# Altium schematic sheet Encoders.SchDoc
size A4; SheetNumber: 5; SheetTotal: 5
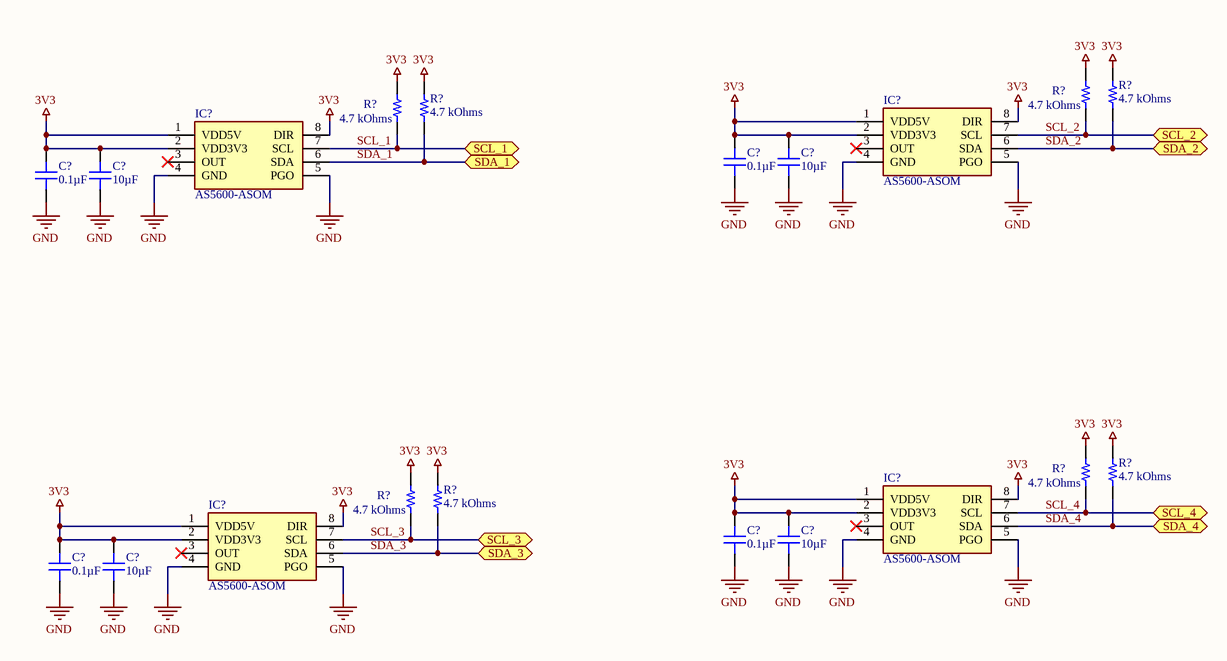
[diagram p0: Encoders.SchDoc]

## Parts
(Parts that share a designator on the sheet are numbered #1, #2 ... from top to bottom, then left to right.)
C?#1  0.1µF  [CAP 0603_1608]
C?#2  10µF  [CAP 0603_1608]
C?#3  0.1µF  [CAP 0603_1608]
C?#4  10µF  [CAP 0603_1608]
C?#5  0.1µF  [CAP 0603_1608]
C?#6  10µF  [CAP 0603_1608]
C?#7  0.1µF  [CAP 0603_1608]
C?#8  10µF  [CAP 0603_1608]
IC?#1  AS5600-ASOM  [SOIC127P600X175-8N]
IC?#2  AS5600-ASOM  [SOIC127P600X175-8N]
IC?#3  AS5600-ASOM  [SOIC127P600X175-8N]
IC?#4  AS5600-ASOM  [SOIC127P600X175-8N]
R?#1  4.7 kOhms  [FileName=C:\Users\Public\Documents\Altium\altium-library\footprints/Resistor - Chip/PCB - RESISTOR - CHIP - RES 0603_1608.PCBLIB|Footprint=RES 0603_1608]
R?#2  4.7 kOhms  [FileName=C:\Users\Public\Documents\Altium\altium-library\footprints/Resistor - Chip/PCB - RESISTOR - CHIP - RES 0603_1608.PCBLIB|Footprint=RES 0603_1608]
R?#3  4.7 kOhms  [FileName=C:\Users\Public\Documents\Altium\altium-library\footprints/Resistor - Chip/PCB - RESISTOR - CHIP - RES 0603_1608.PCBLIB|Footprint=RES 0603_1608]
R?#4  4.7 kOhms  [FileName=C:\Users\Public\Documents\Altium\altium-library\footprints/Resistor - Chip/PCB - RESISTOR - CHIP - RES 0603_1608.PCBLIB|Footprint=RES 0603_1608]
R?#5  4.7 kOhms  [FileName=C:\Users\Public\Documents\Altium\altium-library\footprints/Resistor - Chip/PCB - RESISTOR - CHIP - RES 0603_1608.PCBLIB|Footprint=RES 0603_1608]
R?#6  4.7 kOhms  [FileName=C:\Users\Public\Documents\Altium\altium-library\footprints/Resistor - Chip/PCB - RESISTOR - CHIP - RES 0603_1608.PCBLIB|Footprint=RES 0603_1608]
R?#7  4.7 kOhms  [FileName=C:\Users\Public\Documents\Altium\altium-library\footprints/Resistor - Chip/PCB - RESISTOR - CHIP - RES 0603_1608.PCBLIB|Footprint=RES 0603_1608]
R?#8  4.7 kOhms  [FileName=C:\Users\Public\Documents\Altium\altium-library\footprints/Resistor - Chip/PCB - RESISTOR - CHIP - RES 0603_1608.PCBLIB|Footprint=RES 0603_1608]

## Ports
SCL_1 (bidir), SCL_2 (bidir), SCL_3 (bidir), SCL_4 (bidir), SDA_1 (bidir), SDA_2 (bidir), SDA_3 (bidir), SDA_4 (bidir)

## Nets
3V3: C?#1.2 C?#2.2 C?#3.2 C?#4.2 C?#5.2 C?#6.2 C?#7.2 C?#8.2 IC?#1.1(VDD5V) IC?#1.2(VDD3V3) IC?#1.8(DIR) IC?#2.1(VDD5V) IC?#2.2(VDD3V3) IC?#2.8(DIR) IC?#3.1(VDD5V) IC?#3.2(VDD3V3) IC?#3.8(DIR) IC?#4.1(VDD5V) IC?#4.2(VDD3V3) IC?#4.8(DIR) R?#1.2 R?#2.2 R?#3.2 R?#4.2 R?#5.2 R?#6.2 R?#7.2 R?#8.2
GND: C?#1.1 C?#2.1 C?#3.1 C?#4.1 C?#5.1 C?#6.1 C?#7.1 C?#8.1 IC?#1.4(GND) IC?#1.5(PGO) IC?#2.4(GND) IC?#2.5(PGO) IC?#3.4(GND) IC?#3.5(PGO) IC?#4.4(GND) IC?#4.5(PGO)
SCL_1: IC?#2.7(SCL) R?#3.1 ; port SCL_1
SCL_2: IC?#1.7(SCL) R?#1.1 ; port SCL_2
SCL_3: IC?#4.7(SCL) R?#7.1 ; port SCL_3
SCL_4: IC?#3.7(SCL) R?#5.1 ; port SCL_4
SDA_1: IC?#2.6(SDA) R?#4.1 ; port SDA_1
SDA_2: IC?#1.6(SDA) R?#2.1 ; port SDA_2
SDA_3: IC?#4.6(SDA) R?#8.1 ; port SDA_3
SDA_4: IC?#3.6(SDA) R?#6.1 ; port SDA_4

Not connected (* = marked no-connect by the designer): IC?#1 3(OUT)*; IC?#2 3(OUT)*; IC?#3 3(OUT)*; IC?#4 3(OUT)*

## Library data of the parts
C?#1 C?#3 C?#5 C?#7 = C0603C104K5RAC7411: CAP CER 0.1UF 50V X7R 0603; Manufacturer: KEMET; Tolerance: ±10%; Part Number: C0603C104K5RAC7411; Value: 0.1µF; Applications: Bypass, Decoupling; Capacitance: 0.1µF; ComponentLink1Description: Datasheet; ComponentLink1URL: https://api.kemet.com/component-edge/download/datasheet/C0603C104K5RAC7411.pdf; ComponentLink2Description: DigiKey Link; ComponentLink2URL: http://digikey.com/product-detail/en/kemet/C0603C104K5RAC7411/399-7374-2-ND/3317013; Device Package: 0603 (1608 Metric); LastUpdated: 2020-09-02 1:03:36 AM; Lifecycle Status: Active; Minimum Order: 15000; Mounting Type: Surface Mount, MLCC; Operating Temperature: -55°C ~ 125°C; Package / Case: 0603 (1608 Metric); Packaging: TapeAndReel; PartId: 2233; Part Status: Active; Price: 0.02; Series: SMD Comm X7R; Size / Dimension: 0.063" L x 0.031" W (1.60mm x 0.80mm); Supplier 1: DigiKey; Supplier Part Number 1: 399-7374-2-ND; Temperature Coefficient: X7R; Thickness (Max): 0.035" (0.90mm); Voltage - Rated: 50V
C?#2 C?#4 C?#6 C?#8 = GRM188R61E106MA73D: CAP CER 10UF 25V X5R 0603; Manufacturer: Murata Electronics; Tolerance: ±20%; Part Number: GRM188R61E106MA73D; Value: 10µF; Applications: General Purpose; Capacitance: 10µF; ComponentLink1Description: Datasheet; ComponentLink1URL: https://www.murata.com/~/media/webrenewal/support/library/catalog/products/capacitor/mlcc/c02e.ashx?la=en-us; ComponentLink2Description: DigiKey Link; ComponentLink2URL: http://digikey.com/product-detail/en/murata-electronics/GRM188R61E106MA73D/490-7202-1-ND/3900486; Device Package: 0603 (1608 Metric); LastUpdated: 2020-09-02 1:03:25 AM; Lifecycle Status: Active; Minimum Order: 1; Mounting Type: Surface Mount, MLCC; Operating Temperature: -55°C ~ 85°C; Package / Case: 0603 (1608 Metric); Packaging: TapeAndReel; PartId: 8314; Part Status: Active; Price: 0.09; Series: GRM; Size / Dimension: 0.063" L x 0.031" W (1.60mm x 0.80mm); Supplier 1: DigiKey; Supplier Part Number 1: 490-7202-1-ND; Temperature Coefficient: X5R; Thickness (Max): 0.031" (0.80mm); Voltage - Rated: 25V
IC?#1-IC?#4 = AS5600-ASOM: Integrated Circuit; Manufacturer_Name: ams; Datasheet Link: https://datasheet.datasheetarchive.com/originals/distributors/DKDS-11/214624.pdf; Height: 1.75mm; Manufacturer_Part_Number: AS5600-ASOM; Mouser Part Number: 985-AS5600-ASOM; Mouser Price/Stock: https://www.mouser.co.uk/ProductDetail/ams/AS5600-ASOM?qs=KTMMzrZdriG6aU1h9lJCUQ%3D%3D; Arrow Part Number: AS5600-ASOM; Arrow Price/Stock: https://www.arrow.com/en/products/as5600-asom/ams-ag?region=nac
R?#1-R?#8 = RK73B1JTTD472J: RES 4.7K OHM 5% 1/10W 0603; Manufacturer: KOA Speer Electronics, Inc.; Power (Watts): 0.1W, 1/10W; Temperature Coefficient: ±200ppm/°C; Part Number: RK73B1JTTD472J; Value: 4.7 kOhms; ComponentLink1Description: Datasheet; ComponentLink1URL: http://www.koaspeer.com/catimages/Products/RK73B/RK73B.pdf; ComponentLink2Description: DigiKey Link; ComponentLink2URL: http://digikey.com/product-detail/en/koa-speer-electronics-inc/RK73B1JTTD472J/2019-RK73B1JTTD472JCT-ND/9846743; Composition: Thick Film; Device Package: 0603 (1608 Metric); Features: Automotive AEC-Q200, Moisture Resistant; Height - Seated (Max): 0.022" (0.55mm); LastUpdated: 2020-09-02 1:10:23 AM; Lifecycle Status: Active; Minimum Order: 1; Number of Terminations: 2; Operating Temperature: -55°C ~ 155°C; Package / Case: 0603 (1608 Metric); Packaging: CutTape; PartId: 5830; Part Status: Active; Price: 0.10; Ratings: AEC-Q200; Resistance: 4.7 kOhms; Series: RK73B; Size / Dimension: 0.063" L x 0.031" W (1.60mm x 0.80mm); Supplier 1: DigiKey; Supplier Part Number 1: 2019-RK73B1JTTD472JCT-ND; Supplier Device Package: 0603; Tolerance: ±5%